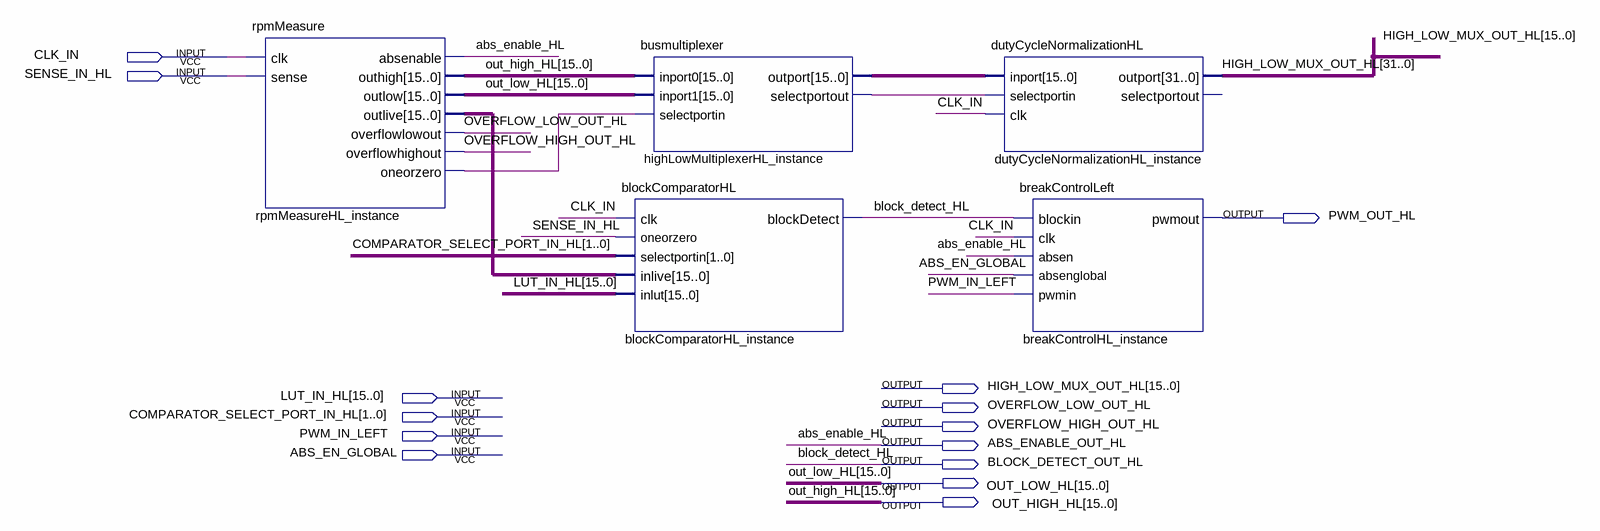
[diagram p0: schematic sheet]
// Quartus schematic absControlHL.bdf as structural Verilog: 5 symbols, 14 pins
module absControlHL (
  input  CLK_IN,
  input  SENSE_IN_HL,
  input  [15:0] LUT_IN_HL,
  input  [1:0] COMPARATOR_SELECT_PORT_IN_HL,
  input  PWM_IN_LEFT,
  input  ABS_EN_GLOBAL,
  output PWM_OUT_HL,
  output [31:0] HIGH_LOW_MUX_OUT_HL,
  output OVERFLOW_LOW_OUT_HL,
  output OVERFLOW_HIGH_OUT_HL,
  output ABS_ENABLE_OUT_HL,
  output BLOCK_DETECT_OUT_HL,
  output [15:0] OUT_LOW_HL,
  output [15:0] OUT_HIGH_HL
);

  wire highLowMultiplexerHL_instance_selectportout, rpmMeasureHL_instance_oneorzero;
  wire [15:0] highLowMultiplexerHL_instance_outport, rpmMeasureHL_instance_outlive;

  rpmMeasure rpmMeasureHL_instance (
    .clk(CLK_IN), .sense(SENSE_IN_HL), .absenable(ABS_ENABLE_OUT_HL), .outhigh(OUT_HIGH_HL),
    .outlow(OUT_LOW_HL), .outlive(rpmMeasureHL_instance_outlive), .overflowlowout(OVERFLOW_LOW_OUT_HL),
    .overflowhighout(OVERFLOW_HIGH_OUT_HL), .oneorzero(rpmMeasureHL_instance_oneorzero));
  busmultiplexer highLowMultiplexerHL_instance (
    .inport0(OUT_HIGH_HL), .inport1(OUT_LOW_HL), .selectportin(rpmMeasureHL_instance_oneorzero),
    .outport(highLowMultiplexerHL_instance_outport),
    .selectportout(highLowMultiplexerHL_instance_selectportout));
  blockComparatorHL blockComparatorHL_instance (
    .clk(CLK_IN), .oneorzero(SENSE_IN_HL), .selectportin(COMPARATOR_SELECT_PORT_IN_HL),
    .inlive(rpmMeasureHL_instance_outlive), .inlut(LUT_IN_HL), .blockDetect(BLOCK_DETECT_OUT_HL));
  dutyCycleNormalizationHL dutyCycleNormalizationHL_instance (
    .inport(highLowMultiplexerHL_instance_outport),
    .selectportin(highLowMultiplexerHL_instance_selectportout), .clk(CLK_IN), .outport(HIGH_LOW_MUX_OUT_HL));  // open: selectportout
  breakControlLeft breakControlHL_instance (
    .blockin(BLOCK_DETECT_OUT_HL), .clk(CLK_IN), .absen(ABS_ENABLE_OUT_HL), .absenglobal(ABS_EN_GLOBAL),
    .pwmin(PWM_IN_LEFT), .pwmout(PWM_OUT_HL));

  // Other names for the same wires on the sheet: abs_enable_HL = ABS_ENABLE_OUT_HL;
  //   block_detect_HL = BLOCK_DETECT_OUT_HL
endmodule
